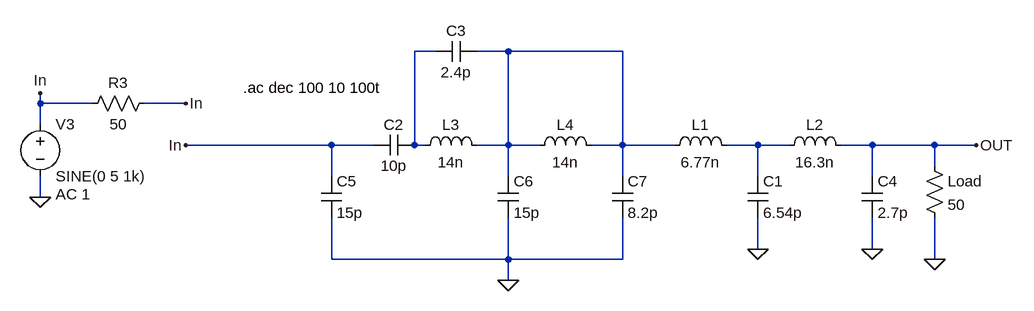
[diagram p0: schematic 433MHz filter with added low pass_vs 2.asc]
433MHz filter with added low pass_vs 2.asc, the LTspice schematic file:
Version 4
SHEET 1 2444 680
WIRE -224 48 -256 48
WIRE -112 48 -160 48
WIRE 64 48 -112 48
WIRE -832 128 -832 112
WIRE -752 128 -832 128
WIRE -608 128 -672 128
WIRE -832 160 -832 128
WIRE -384 192 -608 192
WIRE -320 192 -384 192
WIRE -256 192 -256 48
WIRE -240 192 -256 192
WIRE -112 192 -112 48
WIRE -112 192 -160 192
WIRE -64 192 -112 192
WIRE 64 192 64 48
WIRE 64 192 16 192
WIRE 144 192 64 192
WIRE 272 192 224 192
WIRE 320 192 272 192
WIRE 448 192 400 192
WIRE 544 192 448 192
WIRE 608 192 544 192
WIRE 544 224 544 192
WIRE -384 240 -384 192
WIRE -112 240 -112 192
WIRE 64 240 64 192
WIRE 272 240 272 192
WIRE 448 240 448 192
WIRE -832 272 -832 240
WIRE 272 352 272 304
WIRE 448 352 448 304
WIRE -384 368 -384 304
WIRE -112 368 -112 304
WIRE -112 368 -384 368
WIRE 64 368 64 304
WIRE 64 368 -112 368
WIRE 544 368 544 304
WIRE -112 400 -112 368
FLAG -112 400 0
FLAG 544 368 0
FLAG -832 272 0
FLAG -832 112 In
FLAG -608 128 In
FLAG -608 192 In
FLAG 608 192 OUT
FLAG 448 352 0
FLAG 272 352 0
SYMBOL ind -256 208 R270
WINDOW 0 32 56 VTop 2
WINDOW 3 5 56 VBottom 2
SYMATTR InstName L3
SYMATTR Value 14n
SYMBOL ind -80 208 R270
WINDOW 0 32 56 VTop 2
WINDOW 3 5 56 VBottom 2
SYMATTR InstName L4
SYMATTR Value 14n
SYMBOL cap -400 240 R0
SYMATTR InstName C5
SYMATTR Value 15p
SYMBOL cap -128 240 R0
SYMATTR InstName C6
SYMATTR Value 15p
SYMBOL cap 48 240 R0
SYMATTR InstName C7
SYMATTR Value 8.2p
SYMBOL cap -320 208 R270
WINDOW 0 32 32 VTop 2
WINDOW 3 0 32 VBottom 2
SYMATTR InstName C2
SYMATTR Value 10p
SYMBOL cap -224 64 R270
WINDOW 0 32 32 VTop 2
WINDOW 3 0 32 VBottom 2
SYMATTR InstName C3
SYMATTR Value 2.4p
SYMBOL res 528 208 R0
SYMATTR InstName Load
SYMATTR Value 50
SYMBOL voltage -832 144 R0
WINDOW 123 24 124 Left 2
WINDOW 39 0 0 Left 2
SYMATTR Value2 AC 1
SYMATTR InstName V3
SYMATTR Value SINE(0 5 1k)
SYMBOL res -768 144 R270
WINDOW 0 32 56 VTop 2
WINDOW 3 0 56 VBottom 2
SYMATTR InstName R3
SYMATTR Value 50
SYMBOL ind 128 208 R270
WINDOW 0 32 56 VTop 2
WINDOW 3 5 56 VBottom 2
SYMATTR InstName L1
SYMATTR Value 6.77n
SYMBOL ind 304 208 R270
WINDOW 0 32 56 VTop 2
WINDOW 3 5 56 VBottom 2
SYMATTR InstName L2
SYMATTR Value 16.3n
SYMBOL cap 256 240 R0
SYMATTR InstName C1
SYMATTR Value 6.54p
SYMBOL cap 432 240 R0
SYMATTR InstName C4
SYMATTR Value 2.7p
TEXT -520 104 Left 2 !.ac dec 100 10 100t

The netlist it stands for:
* 433MHz filter with added low pass_vs 2.asc
L3 N001 N002 14n
L4 N002 N002 14n
C5 In 0 15p
C6 N002 0 15p
C7 N002 0 8.2p
C2 In N001 10p
C3 N001 N002 2.4p
R§Load OUT 0 50
V3 In 0 SINE(0 5 1k) AC 1
R3 In In 50
L1 N002 N003 6.77n
L2 N003 OUT 16.3n
C1 N003 0 6.54p
C4 OUT 0 2.7p
.ac dec 100 10 100t
.backanno
.end